# Altium schematic sheet RC_Receive_SCH.SchDoc
size B
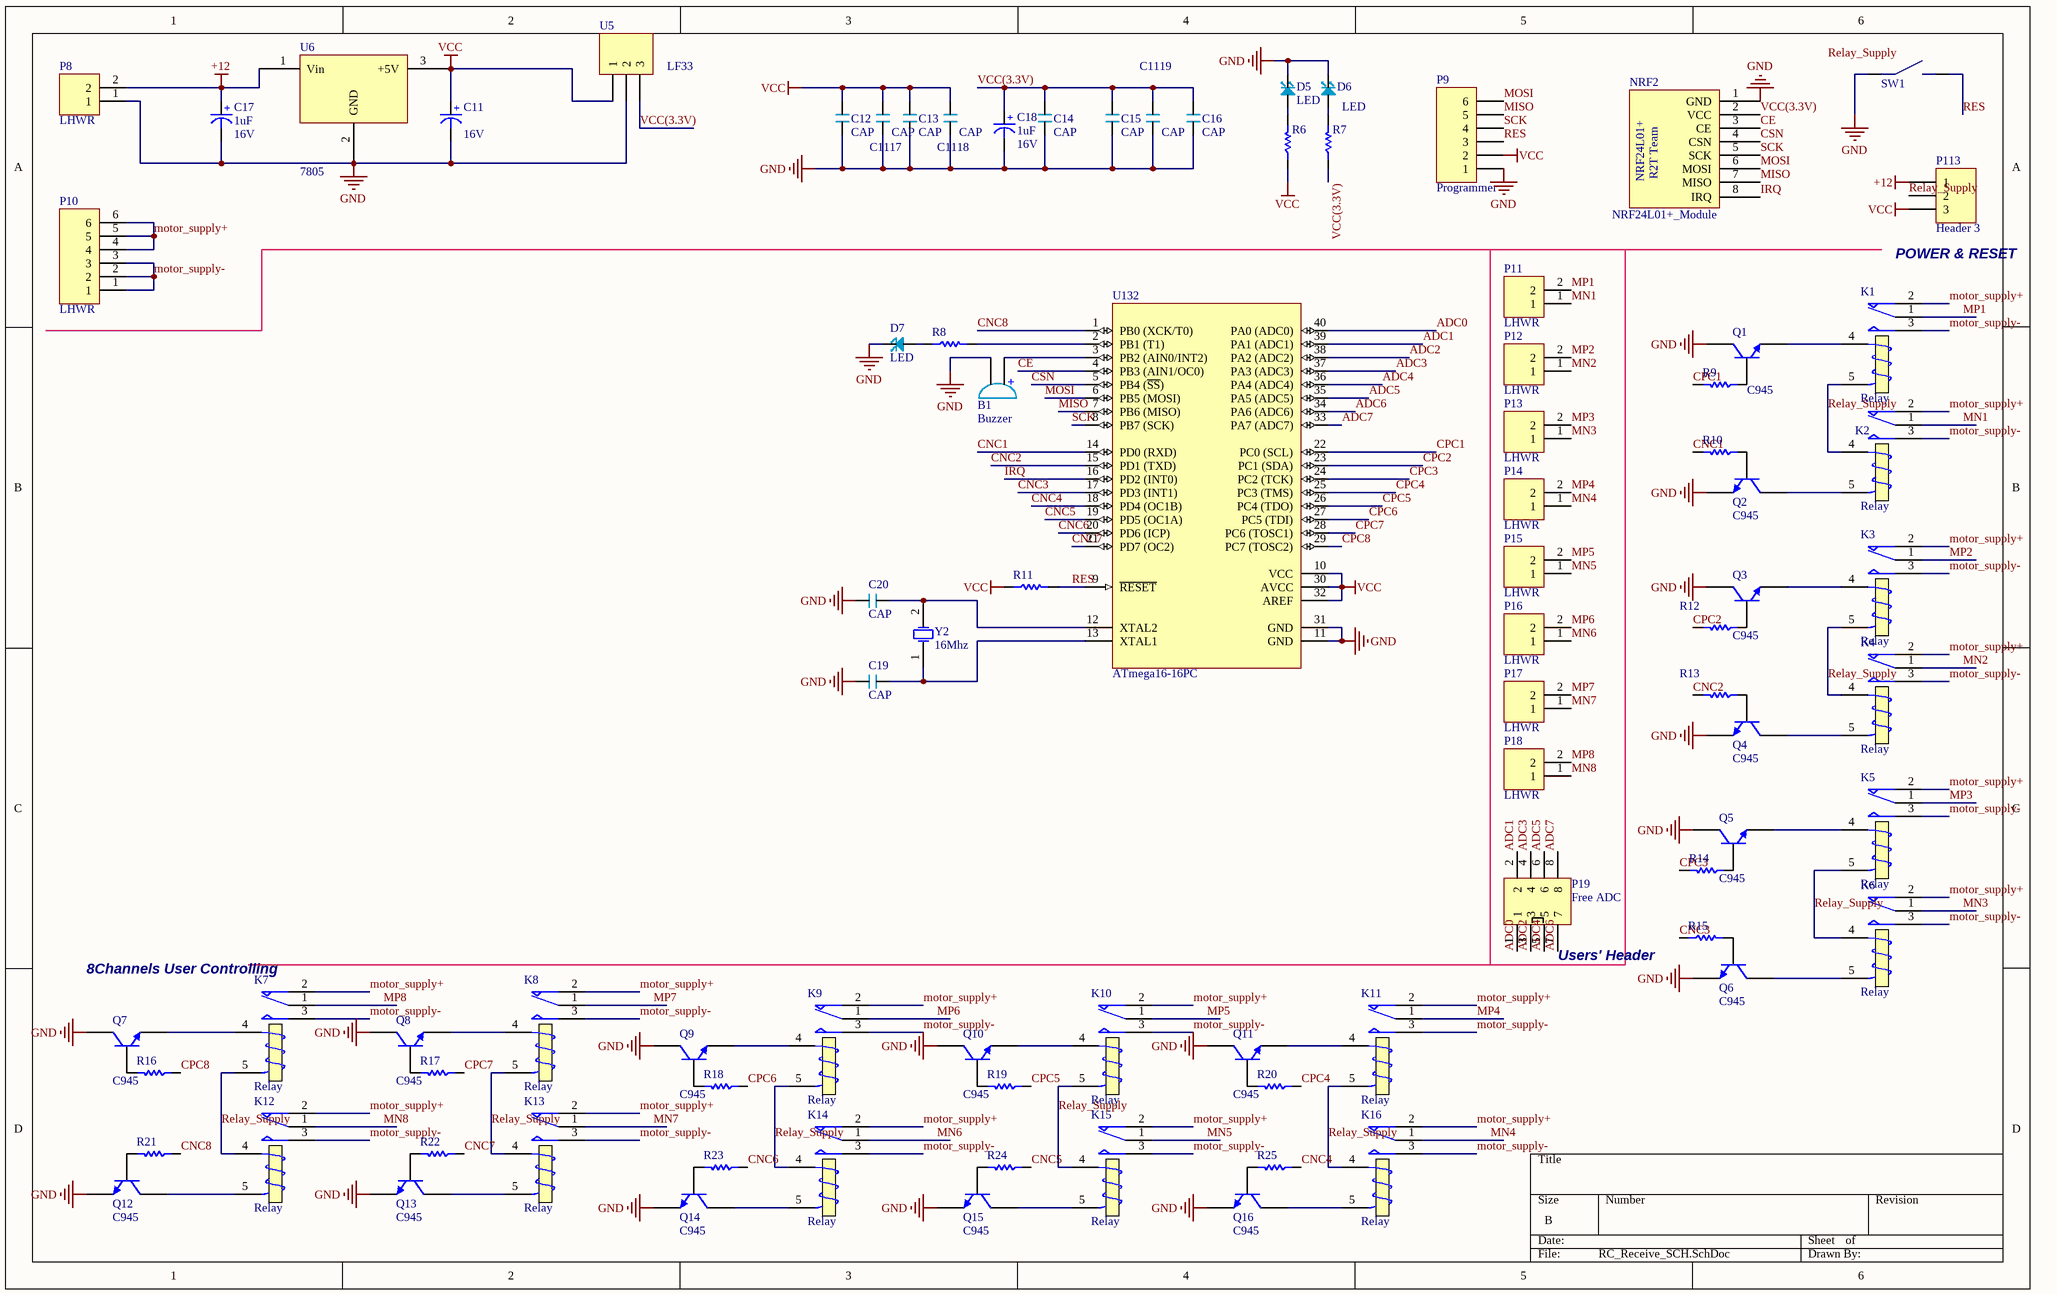
[diagram p0: RC_Receive_SCH.SchDoc]

## Parts
B1  Buzzer  [Buzzer]
C11  Voltage: 16V  [cap 01]
C12  CAP  [RAD_ADA]
C13  CAP  [RAD_ADA]
C14  CAP  [RAD_ADA]
C15  CAP  [RAD_ADA]
C16  CAP  [RAD_ADA]
C17  Voltage: 16V  [cap 01]  (hidden comment: 1uF)
C18  Voltage: 16V  [cap 01]  (hidden comment: 1uF)
C19  CAP  [RAD_ADA]
C20  CAP  [RAD_ADA]
C1117  CAP  [RAD_ADA]
C1118  CAP  [RAD_ADA]
C1119  CAP  [RAD_ADA]
D5  LED  [LED_5MM]
D6  LED  [LED_5MM]
D7  LED  [LED_5MM]
K1  Relay  [Relay 15.40x12.10x13.10]
K2  Relay  [Relay 15.40x12.10x13.10]
K3  Relay  [Relay 15.40x12.10x13.10]
K4  Relay  [Relay 15.40x12.10x13.10]
K5  Relay  [Relay 15.40x12.10x13.10]
K6  Relay  [Relay 15.40x12.10x13.10]
K7  Relay  [Relay 15.40x12.10x13.10]
K8  Relay  [Relay 15.40x12.10x13.10]
K9  Relay  [Relay 15.40x12.10x13.10]
K10  Relay  [Relay 15.40x12.10x13.10]
K11  Relay  [Relay 15.40x12.10x13.10]
K12  Relay  [Relay 15.40x12.10x13.10]
K13  Relay  [Relay 15.40x12.10x13.10]
K14  Relay  [Relay 15.40x12.10x13.10]
K15  Relay  [Relay 15.40x12.10x13.10]
K16  Relay  [Relay 15.40x12.10x13.10]
NRF2  NRF24L01+_Module  [NRF24L01+_Module]
P8  LHWR  [Polarized Header 2]
P9  Programmer  [HDR1X6]
P10  LHWR  [Polarized Header 6]
P11  LHWR  [Polarized Header 2]
P12  LHWR  [Polarized Header 2]
P13  LHWR  [Polarized Header 2]
P14  LHWR  [Polarized Header 2]
P15  LHWR  [Polarized Header 2]
P16  LHWR  [Polarized Header 2]
P17  LHWR  [Polarized Header 2]
P18  LHWR  [Polarized Header 2]
P19  Free ADC  [Box Header 2x4]
P113  Header 3  [HDR1X3]
Q1  C945  [C945]
Q2  C945  [C945]
Q3  C945  [C945]
Q4  C945  [C945]
Q5  C945  [C945]
Q6  C945  [C945]
Q7  C945  [C945]
Q8  C945  [C945]
Q9  C945  [C945]
Q10  C945  [C945]
Q11  C945  [C945]
Q12  C945  [C945]
Q13  C945  [C945]
Q14  C945  [C945]
Q15  C945  [C945]
Q16  C945  [C945]
R6  1K  [Res-(1/4)-Stand]  (value not drawn)
R7  1K  [Res-(1/4)-Stand]  (value not drawn)
R8  1K  [Res-(1/4)-Stand]  (value not drawn)
R9  1K  [Res-(1/4)-Stand]  (value not drawn)
R10  1K  [Res-(1/4)-Stand]  (value not drawn)
R11  1K  [Res-(1/4)-Stand]  (value not drawn)
R12  1K  [Res-(1/4)-Stand]  (value not drawn)
R13  1K  [Res-(1/4)-Stand]  (value not drawn)
R14  1K  [Res-(1/4)-Stand]  (value not drawn)
R15  1K  [Res-(1/4)-Stand]  (value not drawn)
R16  1K  [Res-(1/4)-Stand]  (value not drawn)
R17  1K  [Res-(1/4)-Stand]  (value not drawn)
R18  1K  [Res-(1/4)-Stand]  (value not drawn)
R19  1K  [Res-(1/4)-Stand]  (value not drawn)
R20  1K  [Res-(1/4)-Stand]  (value not drawn)
R21  1K  [Res-(1/4)-Stand]  (value not drawn)
R22  1K  [Res-(1/4)-Stand]  (value not drawn)
R23  1K  [Res-(1/4)-Stand]  (value not drawn)
R24  1K  [Res-(1/4)-Stand]  (value not drawn)
R25  1K  [Res-(1/4)-Stand]  (value not drawn)
SW1  SWITCH  [SWITCH]  (value not drawn)
U5  LF33  [HDR1X3]
U6  7805  [My_TO-220]
U132  ATmega16-16PC  [40P6]
Y2  16Mhz  [XTAL Small]

## Nets
+12: C17.1(+) P8.2 P113.1 U6.1(Vin)
GND: B1.2(GND) C11.2(-) C12.1 C13.1 C14.1 C15.1 C16.1 C17.2(-) C18.2(-) C19.1 C20.2 C1117.1 C1118.1 C1119.1 D5.2 D6.2 D7.2 NRF2.1(GND) P8.1 P9.1 Q1.2(C) Q2.1(E) Q3.2(C) Q4.1(E) Q5.2(C) Q6.1(E) Q7.2(C) Q8.2(C) Q9.2(C) Q10.2(C) Q11.2(C) Q12.1(E) Q13.1(E) Q14.1(E) Q15.1(E) Q16.1(E) SW1.1 U5.2 U6.2(GND) U132.11(GND) U132.31(GND)
VCC: C11.1(+) C12.2 C13.2 C1117.2 C1118.2 P9.2 P113.3 R6.1 R11.1 U5.1 U6.3(+5V) U132.10(VCC) U132.30(AVCC) U132.32(AREF)
ADC0: P19.1 U132.40(PA0_(ADC0))
ADC1: P19.2 U132.39(PA1_(ADC1))
ADC2: P19.3 U132.38(PA2_(ADC2))
ADC3: P19.4 U132.37(PA3_(ADC3))
ADC4: P19.5 U132.36(PA4_(ADC4))
ADC5: P19.6 U132.35(PA5_(ADC5))
ADC6: P19.7 U132.34(PA6_(ADC6))
ADC7: P19.8 U132.33(PA7_(ADC7))
CE: NRF2.3(CE) U132.4(PB3_(AIN1/OC0))
CNC1: R10.2 U132.14(PD0_(RXD))
CNC2: R13.2 U132.15(PD1_(TXD))
CNC3: R15.1 U132.17(PD3_(INT1))
CNC4: R25.1 U132.18(PD4_(OC1B))
CNC5: R24.1 U132.19(PD5_(OC1A))
CNC6: R23.1 U132.20(PD6_(ICP))
CNC7: R22.1 U132.21(PD7_(OC2))
CNC8: R21.1 U132.1(PB0_(XCK/T0))
CPC1: R9.2 U132.22(PC0_(SCL))
CPC2: R12.2 U132.23(PC1_(SDA))
CPC3: R14.2 U132.24(PC2_(TCK))
CPC4: R20.1 U132.25(PC3_(TMS))
CPC5: R19.1 U132.26(PC4_(TDO))
CPC6: R18.1 U132.27(PC5_(TDI))
CPC7: R17.1 U132.28(PC6_(TOSC1))
CPC8: R16.1 U132.29(PC7_(TOSC2))
CSN: NRF2.4(CSN) U132.5(PB4_(~{SS}))
IRQ: NRF2.8(IRQ) U132.16(PD2_(INT0))
MISO: NRF2.7(MISO) P9.5 U132.7(PB6_(MISO))
MN1: K2.1(COM) P11.1
MN2: K4.1(COM) P12.1
MN3: K6.1(COM) P13.1
MN4: K16.1(COM) P14.1
MN5: K15.1(COM) P15.1
MN6: K14.1(COM) P16.1
MN7: K13.1(COM) P17.1
MN8: K12.1(COM) P18.1
MOSI: NRF2.6(MOSI) P9.6 U132.6(PB5_(MOSI))
motor_supply+: K1.2(NC) K2.2(NC) K3.2(NC) K4.2(NC) K5.2(NC) K6.2(NC) K7.2(NC) K8.2(NC) K9.2(NC) K10.2(NC) K11.2(NC) K12.2(NC) K13.2(NC) K14.2(NC) K15.2(NC) K16.2(NC) P10.4 P10.5 P10.6
motor_supply-: K1.3(NO) K2.3(NO) K3.3(NO) K4.3(NO) K5.3(NO) K6.3(NO) K7.3(NO) K8.3(NO) K9.3(NO) K10.3(NO) K11.3(NO) K12.3(NO) K13.3(NO) K14.3(NO) K15.3(NO) K16.3(NO) P10.1 P10.2 P10.3
MP1: K1.1(COM) P11.2
MP2: K3.1(COM) P12.2
MP3: K5.1(COM) P13.2
MP4: K11.1(COM) P14.2
MP5: K10.1(COM) P15.2
MP6: K9.1(COM) P16.2
MP7: K8.1(COM) P17.2
MP8: K7.1(COM) P18.2
Relay_Supply: K1.5(T2) K2.4(T1) K3.5(T2) K4.4(T1) K5.5(T2) K6.4(T1) K7.5(T2) K8.5(T2) K9.5(T2) K10.5(T2) K11.5(T2) K12.4(T1) K13.4(T1) K14.4(T1) K15.4(T1) K16.4(T1) P113.2
RES: P9.3 R11.2 SW1.2 U132.9(~{RESET})
SCK: NRF2.5(SCK) P9.4 U132.8(PB7_(SCK))
VCC(3.3V): C14.2 C15.2 C16.2 C18.1(+) C1119.2 NRF2.2(VCC) R7.1 U5.3
NetB1_1: B1.1(VCC) U132.3(PB2_(AIN0/INT2))
NetC19_2: C19.2 U132.13(XTAL1) Y2.1(OSC1)
NetC20_1: C20.1 U132.12(XTAL2) Y2.2(OSC2)
NetD5_1: D5.1 R6.2
NetD6_1: D6.1 R7.2
NetD7_1: D7.1 R8.1
NetK1_4: K1.4(T1) Q1.1(E)
NetK2_5: K2.5(T2) Q2.2(C)
NetK3_4: K3.4(T1) Q3.1(E)
NetK4_5: K4.5(T2) Q4.2(C)
NetK5_4: K5.4(T1) Q5.1(E)
NetK6_5: K6.5(T2) Q6.2(C)
NetK7_4: K7.4(T1) Q7.1(E)
NetK8_4: K8.4(T1) Q8.1(E)
NetK9_4: K9.4(T1) Q9.1(E)
NetK10_4: K10.4(T1) Q10.1(E)
NetK11_4: K11.4(T1) Q11.1(E)
NetK12_5: K12.5(T2) Q12.2(C)
NetK13_5: K13.5(T2) Q13.2(C)
NetK14_5: K14.5(T2) Q14.2(C)
NetK15_5: K15.5(T2) Q15.2(C)
NetK16_5: K16.5(T2) Q16.2(C)
NetQ1_3: Q1.3(B) R9.1
NetQ2_3: Q2.3(B) R10.1
NetQ3_3: Q3.3(B) R12.1
NetQ4_3: Q4.3(B) R13.1
NetQ5_3: Q5.3(B) R14.1
NetQ6_3: Q6.3(B) R15.2
NetQ7_3: Q7.3(B) R16.2
NetQ8_3: Q8.3(B) R17.2
NetQ9_3: Q9.3(B) R18.2
NetQ10_3: Q10.3(B) R19.2
NetQ11_3: Q11.3(B) R20.2
NetQ12_3: Q12.3(B) R21.2
NetQ13_3: Q13.3(B) R22.2
NetQ14_3: Q14.3(B) R23.2
NetQ15_3: Q15.3(B) R24.2
NetQ16_3: Q16.3(B) R25.2
NetR8_2: R8.2 U132.2(PB1_(T1))

## Notes on the sheet
- POWER & RESET
- (near K7) 8Channels User Controlling
- (near P19) Users' Header
- Labels drawn without touching a wire or pin: Relay_Supply
- (in symbol Buzzer) +
- (in symbol NRF24L01+_Module) NRF24L01+; R2T Team

## Library data of the parts
B1 = Buzzer: Designer: Hamed Jafarzadeh
C11 C17 C18 = Cap-Polar: Polar Capacitor; Designer: Saeid Jorablo; Organazation: ControTec; Adding Date: 1387/12/20
  C17 C18: Value: 1uF
K1-K16 = Relay: SPDT Relay; Designer: Eng. Saeid Jorablo; Company: E.P.I.L; Design_Date: 2011/10/31
NRF2 = NRF24L01+_Module: Designer:: HamedJafarzadeh
P8 P11-P18 = 2pin LHWR: Designer:: Hamed Jafarzadeh - www.R2T.ir
P9 = Header 6: Header, 6-Pin; LatestRevisionDate: 17-Jul-2002; LatestRevisionNote: Re-released for DXP Platform.; Publisher: Altium Limited
P10 = 6pin LHWR: Designer:: Hamed Jafarzadeh - www.R2T.ir
P19 = BoxHeader 2x4: Designer: HamedJafarzadeh - ww.R2T.ir
P113 U5 = Header 3: Header, 3-Pin; LatestRevisionDate: 17-Jul-2002; LatestRevisionNote: Re-released for DXP Platform.; Publisher: Altium Limited
Q1-Q16 = C945: NPN Transistor; Designer: Saeid Jorablo; Company: IPA CO; Last Update Time: 2008/08/04; Value: C945
R6-R25 = Resistor: Tolerance: 5%; Power: 1/8 W; Value: 1K
U6 = 7805: Regulator
U132 = ATmega16-16PC: 8-Bit AVR Microcontroller with 16K Bytes of In-System Programmable Flash Memory; Published: 17-Sep-2003; LatestRevisionDate: 04-Mar-2005; LatestRevisionNote: Stylized 3D Model Added.; DatasheetVersion: 2466E-AVR-10/02; PackageVersion: Dec-1999; PackageReference: 40P6; Publisher: Altium Limited; PackageDescription: DIP; 40 Leads; Row Spacing 15.24 mm; Pitch 2.54 mm; ComponentLink1Description: Manufacturer Link; ComponentLink1URL: http://www.atmel.com; ComponentLink2Description: Datasheet; ComponentLink2URL: http://www.atmel.com/dyn/resources/prod_documents/doc2466.pdf
Y2 = XTAL: XTAL Crystal; Company: E.P.I.L; Design Date: 11/04/2011; Value: 16Mhz